# EAGLE schematic ESP_Clock_v3.1 (EAGLE 9.3.1)
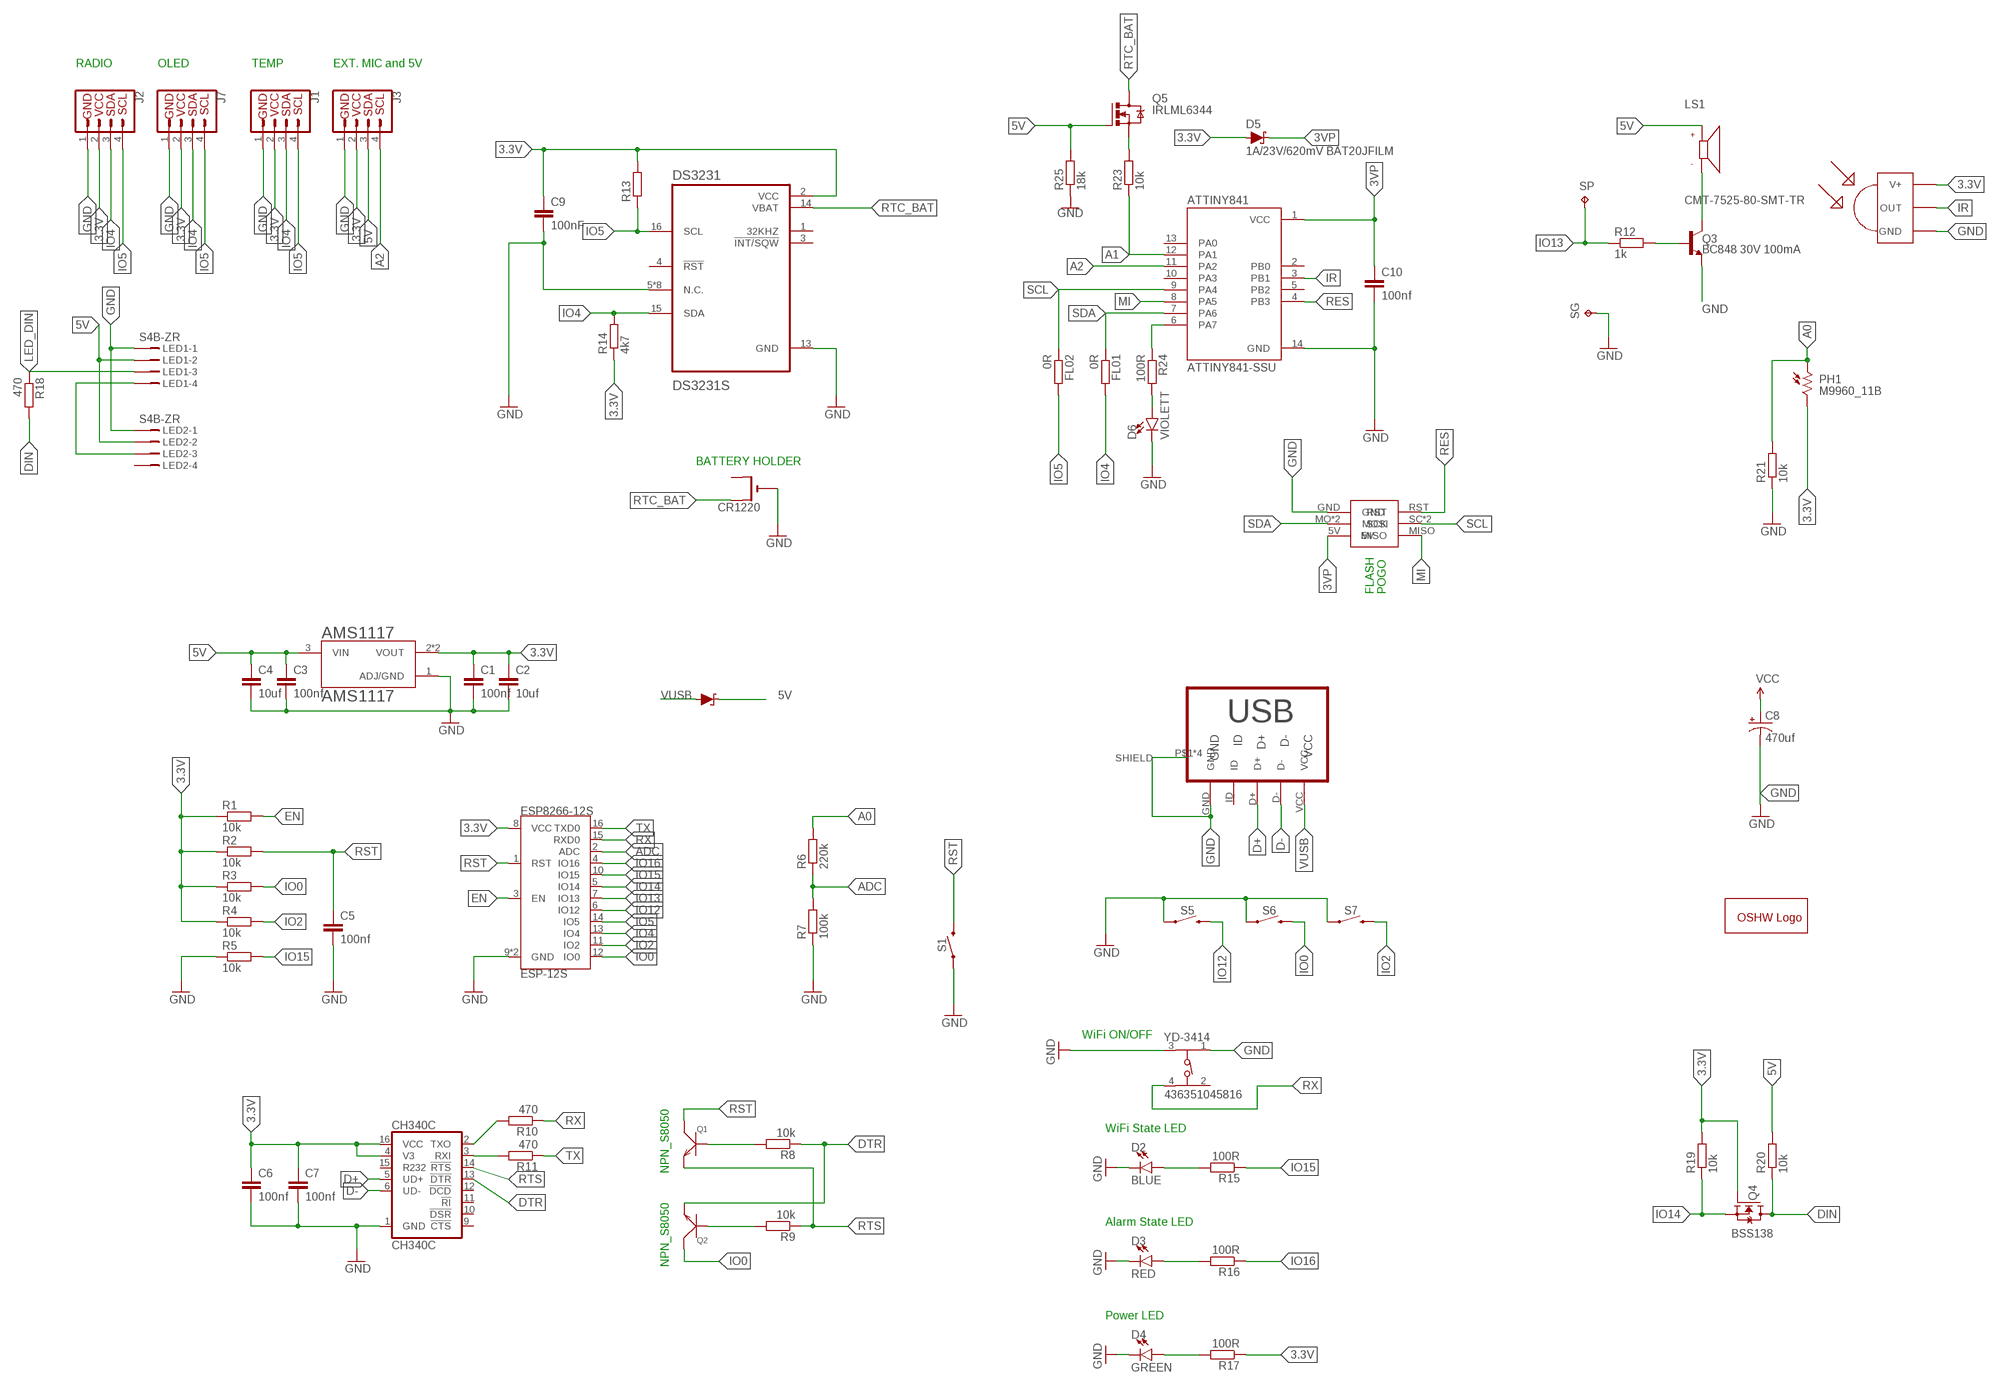
[diagram p0: schematic, sheet 1]

## Parts
AMS1117  AMS1117  [SOT229P700X180-4N]
ATTINY841  ATTINY841-SSU  [SOIC127P599X175-14N]
C1  100nf  C-EUC0603  [C0603]
C2  10uf  C-EUC0805  [C0805]
C3  100nf  C-EUC0603  [C0603]
C4  10uf  C-EUC0805  [C0805]
C5  100nf  C-EUC0603  [C0603]
C6  100nf  C-EUC0603  [C0603]
C7  100nf  C-EUC0603  [C0603]
C8  470uf  CAP_POL7343  [EIA7343]
C9  100nF  C-EUC0603  [C0603]
C10  100nf  C-EUC0603  [C0603]
CH340C  CH340C  [SO016]
CR1220  CR1220SMT  [CR1220-SMD]
D1  MBR130T1G, SL; SOD123 or SMA, 1A  DIODE-SCHOTTKY-B340A  [SMA-DIODE]
D2  BLUE  LED-BLUE0603  [LED-0603]
D3  RED  LED-BLUE0603  [LED-0603]
D4  GREEN  LED-BLUE0603  [LED-0603]
D5  1A/23V/620mV BAT20JFILM  DIODE-SCHOTTKY-BAT20J  [SOD-323]
D6  VIOLETT  LED-BLUE0603  [LED-0603]
DS3231  DS3231S  [SOIC127P1032X265-16N]
ESP8266-12S  ESP-12S  [ESP-12S]
FL01  0R  R-EU_R0603  [R0603]
FL02  0R  R-EU_R0603  [R0603]
GOLD_ORB_SM1  OSHWLOGOLOGO5MM  [OSHW_5MM]
J1  QWIIC_CONNECTORJS-1MM  [1X04_1MM_RA]
J2  QWIIC_CONNECTORJS-1MM  [1X04_1MM_RA]
J3  QWIIC_CONNECTORJS-1MM  [1X04_1MM_RA]
J7  QWIIC_CONNECTORJS-1MM  [1X04_1MM_RA]
LED1  S4B-ZR  [S4B-ZR]
LED2  S4B-ZR  [S4B-ZR]
LS1  CMT-7525-80-SMT-TR  [XDCR_CMT-7525-80-SMT-TR]
MICRO-USB  MICRO-USB-B  [MICRO_USB_4_LEGS]
PH1  M9960_11B  [M9960]
Q1  NPN_S8050  SMD-TRANSISTORS-NPN-25V-500MW(SOT-23)  [SOT-23]
Q2  NPN_S8050  SMD-TRANSISTORS-NPN-25V-500MW(SOT-23)  [SOT-23]
Q3  BC848 30V 100mA  TRANS_NPN-MMBT2222AL  [SOT23-3]
Q4  BSS138  [SOT95P240X111-3N]
Q5  IRLML6344  [SOT23]
R1  10k  R-EU_R0603  [R0603]
R2  10k  R-EU_R0603  [R0603]
R3  10k  R-EU_R0603  [R0603]
R4  10k  R-EU_R0603  [R0603]
R5  10k  R-EU_R0603  [R0603]
R6  220k  R-EU_R0603  [R0603]
R7  100k  R-EU_R0603  [R0603]
R8  10k  R-EU_R0603  [R0603]
R9  10k  R-EU_R0603  [R0603]
R10  470  R-EU_R0603  [R0603]
R11  470  R-EU_R0603  [R0603]
R12  1k  R-EU_R0603  [R0603]
R13  4k7  R-EU_R0603  [R0603]
R14  4k7  R-EU_R0603  [R0603]
R15  100R  R-EU_R0603  [R0603]
R16  100R  R-EU_R0603  [R0603]
R17  100R  R-EU_R0603  [R0603]
R18  470  R-EU_R0603  [R0603]
R19  10k  R-EU_R0603  [R0603]
R20  10k  R-EU_R0603  [R0603]
R21  10k  R-EU_R0603  [R0603]
R23  10k  R-EU_R0603  [R0603]
R24  100R  R-EU_R0603  [R0603]
R25  18k  R-EU_R0603  [R0603]
S1  MOMENTARY-SWITCH-SPST-SMD-4.6X2.8MM  [TACTILE_SWITCH_SMD_4.6X2.8MM]
S5  MOMENTARY-SWITCH-SPST-SMD-4.6X2.8MM  [TACTILE_SWITCH_SMD_4.6X2.8MM]
S6  MOMENTARY-SWITCH-SPST-SMD-4.6X2.8MM  [TACTILE_SWITCH_SMD_4.6X2.8MM]
S7  MOMENTARY-SWITCH-SPST-SMD-4.6X2.8MM  [TACTILE_SWITCH_SMD_4.6X2.8MM]
SG  TPB1,27  [B1,27]
SP  TPB1,27  [B1,27]
U$1  ISCP_PORTPOGONEW  [ISCP_PADS_2ROW2HNEW]
U$2  TSOP4838  [TSOP18XX]
YD-3414  436351045816  [4363X10458XX]

## Nets
3.3V: AMS1117.2(VOUT) AMS1117.4(VOUT) C1.1 C2.1 C6.1 C7.1 C9.1 CH340C.4(V3) CH340C.16(VCC) D5.A DS3231.2(VCC) ESP8266-12S.8(VCC) J1.2(VCC) J2.2(VCC) J3.2(VCC) J7.2(VCC) PH1.2 Q4.1(G) R1.1 R2.1 R3.1 R4.1 R13.2 R14.1 R17.1 R19.2 U$2.VCC(V+)
3VP: ATTINY841.1(VCC) C10.1 D5.C U$1.5V
5V: AMS1117.3(VIN) C3.1 C4.1 C8.A(+) D1.C J3.3(SDA) LED1.2 LED2.2 LS1.P Q5.1(G) R20.2 R25.2 ; supply symbol labelled VCC
A0: PH1.1 R6.2 R21.2
A1: ATTINY841.12(PA1) R23.1
A2: ATTINY841.11(PA2) J3.4(SCL)
ADC: ESP8266-12S.2(ADC) R6.1 R7.2
D+: CH340C.5(UD+) MICRO-USB.D+
D-: CH340C.6(UD-) MICRO-USB.D-
DIN: Q4.3(D) R18.2 R20.1
DTR: CH340C.13(!DTR) Q2.2(E) R8.1
EN: ESP8266-12S.3(EN) R1.2
GND: AMS1117.1(ADJ/GND) ATTINY841.14(GND) C1.2 C2.2 C3.2 C4.2 C5.2 C6.2 C7.2 C8.C(-) C9.2 C10.2 CH340C.1(GND) CR1220.- D2.C D3.C D4.C D6.C DS3231.5(N.C.) DS3231.6(N.C.) DS3231.7(N.C.) DS3231.8(N.C.) DS3231.9(N.C.) DS3231.10(N.C.) DS3231.11(N.C.) DS3231.12(N.C.) DS3231.13(GND) ESP8266-12S.9(GND) ESP8266-12S.P$1(GND) J1.1(GND) J2.1(GND) J3.1(GND) J7.1(GND) LED1.1 LED2.1 MICRO-USB.GND MICRO-USB.P$1(SHIELD) MICRO-USB.P$2(SHIELD) MICRO-USB.P$3(SHIELD) MICRO-USB.P$5(SHIELD) Q3.2(E) R5.1 R7.1 R21.1 R25.1 S1.1 S1.2 S5.1 S5.2 S6.1 S6.2 S7.1 S7.2 SG.TP U$1.GND U$2.GND YD-3414.1 YD-3414.3
IO0: ESP8266-12S.12(IO0) Q2.3(C) R3.2 S6.3 S6.4
IO2: ESP8266-12S.11(IO2) R4.2 S7.3 S7.4
IO4: DS3231.15(SDA) ESP8266-12S.13(IO4) FL01.2 J1.3(SDA) J2.3(SDA) J7.3(SDA) R14.2
IO5: DS3231.16(SCL) ESP8266-12S.14(IO5) FL02.2 J1.4(SCL) J2.4(SCL) J7.4(SCL) R13.1
IO12: ESP8266-12S.6(IO12) S5.3 S5.4
IO13: ESP8266-12S.7(IO13) R12.1 SP.TP
IO14: ESP8266-12S.5(IO14) Q4.2(S) R19.1
IO15: ESP8266-12S.10(IO15) R5.2 R15.1
IO16: ESP8266-12S.4(IO16) R16.1
IR: ATTINY841.3(PB1) U$2.OUT
LED_DIN: LED1.3 R18.1
MI: ATTINY841.8(PA5) U$1.MISO
N$1: Q3.1(B) R12.2
N$2: LED1.4 LED2.3
N$3: Q1.1(B) R8.2
N$4: Q2.1(B) R9.2
N$5: Q5.2(S) R23.2
N$6: D6.A R24.2
N$7: ATTINY841.6(PA7) R24.1
N$8: D3.A R16.2
N$9: D2.A R15.2
N$10: D4.A R17.2
N$11: CH340C.3(RXI) R11.2
N$12: CH340C.2(TXO) R10.2
N$13: LS1.N Q3.3(C)
RES: ATTINY841.4(PB3) U$1.RST
RST: C5.1 ESP8266-12S.1(RST) Q1.3(C) R2.2 S1.3 S1.4
RTC_BAT: CR1220.+$1(+) DS3231.14(VBAT) Q5.3(D)
RTS: CH340C.14(!RTS) Q1.2(E) R9.1
RX: ESP8266-12S.15(RXD0) R10.1 YD-3414.4
SCL: ATTINY841.9(PA4) FL02.1 U$1.SC(SCK) U$1.SCK
SDA: ATTINY841.7(PA6) FL01.1 U$1.MO(MOSI) U$1.MOSI
TX: ESP8266-12S.16(TXD0) R11.1
VUSB: D1.A MICRO-USB.VCC
Unconnected: ATTINY841.2(PB0) ATTINY841.5(PB2) ATTINY841.10(PA3) ATTINY841.13(PA0) CH340C.9(!CTS) CH340C.10(!DSR) CH340C.11(!RI) CH340C.12(!DCD) CH340C.15(R232) CR1220.+$2(+1) DS3231.1(32KHZ) DS3231.3(!INT/SQW) DS3231.4(!RST) LED2.4 MICRO-USB.ID YD-3414.2

## Notes on the sheet
- RADIO | OLED | TEMP | EXT. MIC and 5V
- BATTERY HOLDER
- FLASH 
  POGO
- WiFi ON/OFF
- NPN_S8050
- WiFi State LED
- NPN_S8050
- Alarm State LED
- Power LED

## Library data of the parts
AMS1117 = AMS1117:AMS1117: Sot223/Pkg 1-Amp 5-Volt Low Drop Out Voltage Regulatator; AVAILABILITY: Unavailable; DESCRIPTION: 1A LOW DROPOUT VOLTAGE REGULATOR SOT-223; MF: Advanced Monolithic Systems; MP: AMS1117; PACKAGE: SOT-223 Seeed Technology; PRICE: None
ATTINY841 = ATTINY841-SSU:ATTINY841-SSU: MCU 8-bit ATtiny AVR CISC 8KB Flash 1.8V/2.5V/3.3V/5V 14-Pin SOIC W Tray Check prices <https://pricing.snapeda.com/parts/ATTINY841-SSU/Microchip/view-part?ref=eda>; AVAILABILITY: Good; DESCRIPTION: AVR AVR® ATtiny Microcontroller IC 8-Bit 16MHz 8KB (8K x 8) FLASH 14-SOIC; MF: Microchip; MP: ATTINY841-SSU; PACKAGE: SOIC-14 Microchip; PRICE: None; PURCHASE-URL: https://pricing.snapeda.com/search/part/ATTINY841-SSU/?ref=eda
C1-C7 C9 C10 = resistor:C-EU: CAPACITOR, European symbol
C8 = SparkFun-Passives:CAP_POL: Capacitor Polarized These are standard SMD and PTH capacitors. Normally 10uF, 47uF, and 100uF in electrolytic and tantalum varieties. Always verify the external diameter of the through hole cap, it varies with capacity, voltage, and manufacturer. The EIA devices should be standard.
CH340C = CH340C:CH340C; AVAILABILITY: Unavailable; DESCRIPTION: USB to serial chip CH340; MF: WCH; MP: CH340C; PACKAGE: Package; PRICE: None
CR1220 = adafruit:CR1220: CR1216/CR1220/CR1225 12mm 3V lithium coin cell Great for battery packup. Both SMT and THM holders. Note the THM package has the ground pads on both sides of the PCB so that the masks are the same - this reduces the cost
D1 = SparkFun-DiscreteSemi:DIODE-SCHOTTKY: Schottky diode A Schottky diode is a semiconductor diode which has a low forward voltage drop and a very fast switching action.; PROD_ID: DIO-09886; VALUE: 3A/40V/500mV
D2 = SparkFun-LED:LED-BLUE: Blue SMD LED Used in manufacturing of various products at SparkFun Packages: 0603 - SMD 0603 package [Product Link] <http://www.digikey.com/product-detail/en/SMLE12BC7TT86/511-1589-2-ND/1641808> 1206 - SMD1206 package [Product Link] <http://www.digikey.com/product-detail/en/lite-on-inc/LTST-C150TBKT/160-1643-1-ND/573584> SparkFun Products: ESP8266 Thing-Dev Board <https://www.sparkfun.com/products/13711> RedBoard <https://www.sparkfun.com/products/12757>; PROD_ID: DIO-08575
D3 D4 D6 = SparkFun-LED:LED-BLUE: Blue SMD LED Used in manufacturing of various products at SparkFun Packages: 0603 - SMD 0603 package [Product Link] <http://www.digikey.com/product-detail/en/SMLE12BC7TT86/511-1589-2-ND/1641808> 1206 - SMD1206 package [Product Link] <http://www.digikey.com/product-detail/en/lite-on-inc/LTST-C150TBKT/160-1643-1-ND/573584> SparkFun Products: ESP8266 Thing-Dev Board <https://www.sparkfun.com/products/13711> RedBoard <https://www.sparkfun.com/products/12757>; PROD_ID: DIO-08575; VALUE: BLUE
D5 = SparkFun-DiscreteSemi:DIODE-SCHOTTKY: Schottky diode A Schottky diode is a semiconductor diode which has a low forward voltage drop and a very fast switching action.; PROD_ID: DIO-11623; VALUE: 1A/23V/620mV
DS3231 = DS3231S:DS3231S: Check prices <https://pricing.snapeda.com/parts/DS3231S/Maxim%20Integrated/view-part?ref=eda>; AVAILABILITY: Warning; DESCRIPTION: Real Time Clock (RTC) IC Clock/Calendar I²C, 2-Wire Serial 16-SOIC (0.295, 7.50mm Width); MF: Maxim Integrated; MP: DS3231S; PACKAGE: SOIC-16 Maxim Integrated; PRICE: None; PURCHASE-URL: https://pricing.snapeda.com/search/part/DS3231S/?ref=eda
ESP8266-12S = ESP-12S:ESP-12S: AI-Thinker ESP-12S ESP-12S WiFi module is developed by AI-Thinker Co.,Ltd, core processor ESP8266 in smaller sizes of the module encapsulates Tensilica L106 integrates industry-leading ultra low power 32-bit MCU micro, with the 16-bit short mode, clock speed support 80 MHz, 160 MHz, supports the RTOS, integrated Wi-Fi MAC/BB/RF/PA/LNA, on-board antennas. Check prices <https://pricing.snapeda.com/parts/ESP-12S/RF%20Solutions/view-part?ref=eda>; AVAILABILITY: Bad; DESCRIPTION: WiFi 802.11b/g/n Transceiver Module 2.412GHz ~ 2.484GHz PCB Trace Surface Mount; MF: RF Solutions; MP: ESP-12S; PACKAGE: Module RF Solutions; PRICE: None; PURCHASE-URL: https://pricing.snapeda.com/search/part/ESP-12S/?ref=eda
FL01 FL02 R12 R21 R23 R24 = rcl:R-EU_: RESISTOR, European symbol; SPICEPREFIX: R
GOLD_ORB_SM1 = oshw:OSHWLOGO: The OSHW logo for PCB layout
J1-J3 J7 = SparkFun-Connectors:QWIIC_CONNECTOR: SparkFun I2C Standard Qwiic Connector An SMD 1mm pitch JST connector makes it easy and quick (get it? Qwiic?) to connect I2C devices to each other. The Qwiic system <http://www.sparkfun.com/qwiic> enables fast and solderless connection between popular platforms and various sensors and actuators. We carry 200mm <https://www.sparkfun.com/products/14204>, 100mm <https://www.sparkfun.com/products/14205>, 50mm <https://www.sparkfun.com/products/14206>, and breadboard friendly <https://www.sparkfun.com/products/14207> Qwiic cables. We also offer 10 pcs strips <https://www.sparkfun.com/products/14323> the SMD connectors.
LED1 LED2 = con-jst:?4B-ZR: ZH CONNECTOR 1.5 mm, 4 pin 1 row Source: http://www.jst.com .. eZH.pdf; MF: FARNELL; MPN: S4B-ZR(LF)(SN); OC_FARNELL: 9491830; OC_NEWARK: 38K8076
LS1 = CMT-7525-80-SMT-TR:CMT-7525-80-SMT-TR: CMT-7525-80-SMT-TR Check prices <https://pricing.snapeda.com/parts/CMT-7525-80-SMT-TR/CUI%20Devices/view-part?ref=eda>; AVAILABILITY: Good; CUI_PURCHASE_URL: https://www.cuidevices.com/product/audio/buzzers/audio-transducers/cmt-7525-80-smt-tr?utm_source=snapeda.com&utm_medium=referral&utm_campaign=snapedaBOM; DESCRIPTION: 7.5 mm, 3.6 Vo-p, 80 dB, Surface Mount (SMT), Magnetic Audio Transducer Buzzer; MF: CUI Devices; MP: CMT-7525-80-SMT-TR; PACKAGE: CUI Devices; PRICE: None; PURCHASE-URL: https://pricing.snapeda.com/search/part/CMT-7525-80-SMT-TR/?ref=eda
MICRO-USB = micro usb B - 4LEGS_ak:MICRO-USB-B
PH1 = photo-elements:M9960_11: Photo Sensor Beacon Light, Photometer Applications Source: http://optoelectronics.perkinelmer.com/content/Datasheets/DTS_M9960.pdf
Q1 Q2 = SMD-TRANSISTORS-NPN-25V-500MW_SOT-23_:SMD-TRANSISTORS-NPN-25V-500MW(SOT-23): 305010017 Check prices <https://pricing.snapeda.com/parts/S8050/Microdiode%20Electronics/view-part?ref=eda>; AVAILABILITY: Warning; DESCRIPTION: S8050; MF: Microdiode Electronics; MP: S8050; PACKAGE: None; PRICE: None
Q3 = SparkFun-DiscreteSemi:TRANS_NPN: NPN transistor Current controlled devices typically used to amplify current or used as a switch. BC547 - COM-08928 <http://www.sparkfun.com/products/8928> (TO-92 45V 100mA) (1.Collector 2.Base 3.Emitter) 2N3904 - COM-00521 <http://www.sparkfun.com/products/521> (TO-92 40V 200mA) (1.Emitter 2.Base 3.Collector) P2N2222A - COM-12852 <http://www.sparkfun.com/products/12852> (TO-92 40V 600mA) (1.Collector 2.Base 3.Emitter); PROD_ID: TRANS-08049; VALUE: 600mA/40V
Q4 = BSS138:BSS138: N-Channel 50V 220mA (Ta) 360mW (Ta) Surface Mount SOT-23-3 Check prices <https://pricing.snapeda.com/parts/BSS138/ON%20Semiconductor/view-part?ref=eda>; AVAILABILITY: Good; DESCRIPTION: N-Channel 50V 220mA (Ta) 360mW (Ta) Surface Mount SOT-23-3; MF: ON Semiconductor; MP: BSS138; PACKAGE: SOT-23 ON; PRICE: None; PURCHASE-URL: https://pricing.snapeda.com/search/part/BSS138/?ref=eda
Q5 = IRLML6344:IRLML6344: N-CHANNEL MOS FET Check availability <https://pricing.snapeda.com/parts/IRLML6344/Infineon%20Technologies/view-part?ref=eda>; AVAILABILITY: In Stock; DESCRIPTION: Trans MOSFET N-CH 30V 5A 3-Pin SOT-23 T/R; MF: Infineon Technologies; MP: IRLML6344; PACKAGE: None; PRICE: None; PURCHASE-URL: https://pricing.snapeda.com/search/part/IRLML6344/?ref=eda
R1-R11 R13-R20 R25 = resistor:R-EU_: RESISTOR, European symbol
S1 S5-S7 = SparkFun-Switches:MOMENTARY-SWITCH-SPST: Momentary Switch (Pushbutton) - SPST Normally-open (NO) SPST momentary switches (buttons, pushbuttons). Variants PTH-12MM - 12mm square, through-hole Momentary Pushbutton Switch - 12mm Square <https://www.sparkfun.com/products/9190> (COM-09190) PTH-6.0MM, PTH-6.0MM-KIT - 6.0mm square, through-hole Mini Pushbutton Switch <https://www.sparkfun.com/products/97> (COM-00097) KIT package intended for soldering kit's - only one side of pads' copper is exposed. PTH-RIGHT-ANGLE-KIT - Right-angle, through-hole Right Angle Tactile Button <https://www.sparkfun.com/products/10791> - Used on SparkFun BigTime Watch Kit <https://www.sparkfun.com/products/11734> SMD-12MM - 12mm square, surface-mount Tactile Button - SMD (12mm) <https://www.sparkfun.com/products/12993> (COM-12993) Used on SparkFun PicoBoard <https://www.sparkfun.com/products/11888> SMD-4.5MM - 4.5mm Square Trackball Switch Used on SparkFun Blackberry Trackballer Breakout <https://www.sparkfun.com/products/13169> SMD-4.6MMX2.8MM - 4.60mm x 2.80mm, surface mount Used on SparkFun SAMD21 Mini Breakout <https://www.sparkfun.com/products/13664> SMD-5.2MM, SMD-5.2-REDUNDANT - 5.2mm square, surface-mount Mini Pushbutton Switch - SMD <https://www.sparkfun.com/products/8720> (COM-08720) Used on Arduino Pro Mini <https://www.sparkfun.com/products/11114> REDUNDANT package connects both switch circuits together SMD-6.0X3.5MM - 6.0 x 3.5mm, surface mount Momentary Reset Switch SMD <https://www.sparkfun.com/products/8229> (COM-08229) SMD-6.2MM-TALL - 6.2mm square, surface mount Tactile Button - SMD (6mm) <https://www.sparkfun.com/products/12992> Used on SparkFun Digital Sandbox <https://www.sparkfun.com/products/12651> SMD-RIGHT-ANGLE - Right-angle, surface mount Used on SparkFun Block for Intel® Edison - Arduino <https://www.sparkfun.com/products/13036>; PROD_ID: SWCH-13065
SG SP = testpad:TP: Test pad
U$1 = CoreDuino:ISCP_PORT
U$2 = TSOP4838:TSOP4838: IR Receiver and Demodulator Check prices <https://pricing.snapeda.com/parts/TSOP4838/Vishay/view-part?ref=eda>; AVAILABILITY: Good; DESCRIPTION: Remote Receiver Sensor, 38.0kHz 45m Through Hole; MF: Vishay; MP: TSOP4838; PACKAGE: DIP-3 Vishay; PRICE: None; PURCHASE-URL: https://pricing.snapeda.com/search/part/TSOP4838/?ref=eda
YD-3414 = Eagle_WS-TASU (rev21a):436351045816: WS-TASU SMT Tact Switch with Boss Design 4.7x3.5 mm side push MATERIAL PROPERTIES Cover Material:Stainless Steel PROPERTIES Actuator Material:PA46 Actuator Flammability Rating: UL94 HB Actuator Color: Black; White Frame Material: PA46 Frame Flammability: UL94 HB Frame Color:Black;White Contact Material Stainless Steel Contact Plating Silver Terminal Material Copper Alloy Terminal Plating Silver VR 12 V (DC) Contact Resistance Initial 100 mΩ Contact Resistance After Life Test 1 Ω RISO 100 MΩ Withstanding Voltage 250 V (AC) Washable No Qty. 3300 Mechanical Properties Stroke:0.25 mm; 0.3 mm GENERAL INFORMATION Operating Temperature -40 up to +85 °C Washable:No PACKAGING PROPERTIES Packaging Tape and Reel <https://www.we-online.com/catalog/media/o61089v209%20Family_WS_TUS_Normal_SMD_J-Bend_4363x10458xx_pf2.jpg> Details see: https://www.we-online.com/catalog/en/TASU_3_5X4_7_SMD_SIDE_PUSH_BOSS_DESIGN/ Updated by Yingchun, Shan 2020-02-17 2020(C) Wurth Elektronik; DATASHEET-URL: https://www.we-online.com/catalog/datasheet/436351045816.pdf; H: 1.65mm; OPERATION-FORCE: 160g; PART-NUMBER: 436351045816; QTY: 3300

## Net classes
2 medium: width 0.305 mm, drill 0.3 mm, clearance 0.305 mm